# Altium schematic sheet Display.SchDoc
size A; DocumentNumber: 4; SheetNumber: 4; SheetTotal: 5
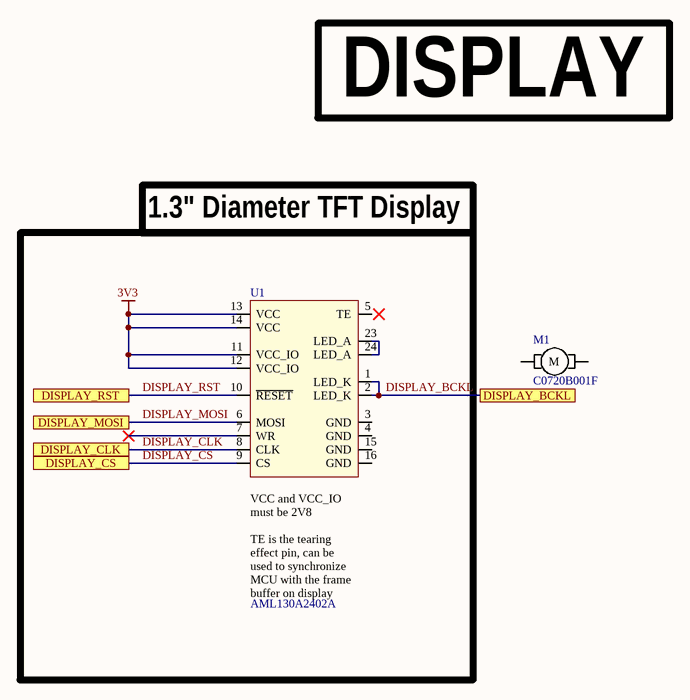
[diagram p0: Display.SchDoc]

## Parts
M1  C0720B001F  [C0720B001F]
U1  AML130A2402A  [AML130A2402A]

## Blocks framed on the sheet
1.3" Diameter TFT Display: U1

## Ports
DISPLAY_BCKL, DISPLAY_CLK, DISPLAY_CS, DISPLAY_MOSI, DISPLAY_RST

## Nets
3V3: U1.11(VCC_IO) U1.12(VCC_IO) U1.13(VCC) U1.14(VCC)
DISPLAY_BCKL: U1.1(LED_K) U1.2(LED_K) ; port DISPLAY_BCKL
DISPLAY_CLK: U1.8(CLK) ; port DISPLAY_CLK
DISPLAY_CS: U1.9(CS) ; port DISPLAY_CS
DISPLAY_MOSI: U1.6(MOSI) ; port DISPLAY_MOSI
DISPLAY_RST: U1.10(~{RESET}) ; port DISPLAY_RST
NetU1_23: U1.23(LED_A) U1.24(LED_A)

Not connected (* = marked no-connect by the designer): M1 1 2; U1 3(GND) 4(GND) 5(TE) 7(WR)* 15(GND) 16(GND)

## Notes on the sheet
- DISPLAY
- (in symbol AML130A2402A) VCC and VCC_IO must be 2V8 / TE is the tearing effect pin, can be used to synchronize MCU with the frame buffer on display
- (in symbol C0720B001F) M

## Library data of the parts
M1 = C0720B001F: DC Motor Vibration, ERM 10000 RPM 3VDC
U1 = AML130A2402A: AML130A2402A Round 1.3" TFT Display